# EAGLE design 130909_MAXSONAR_AriloRX_0_0 (EAGLE 6.4)
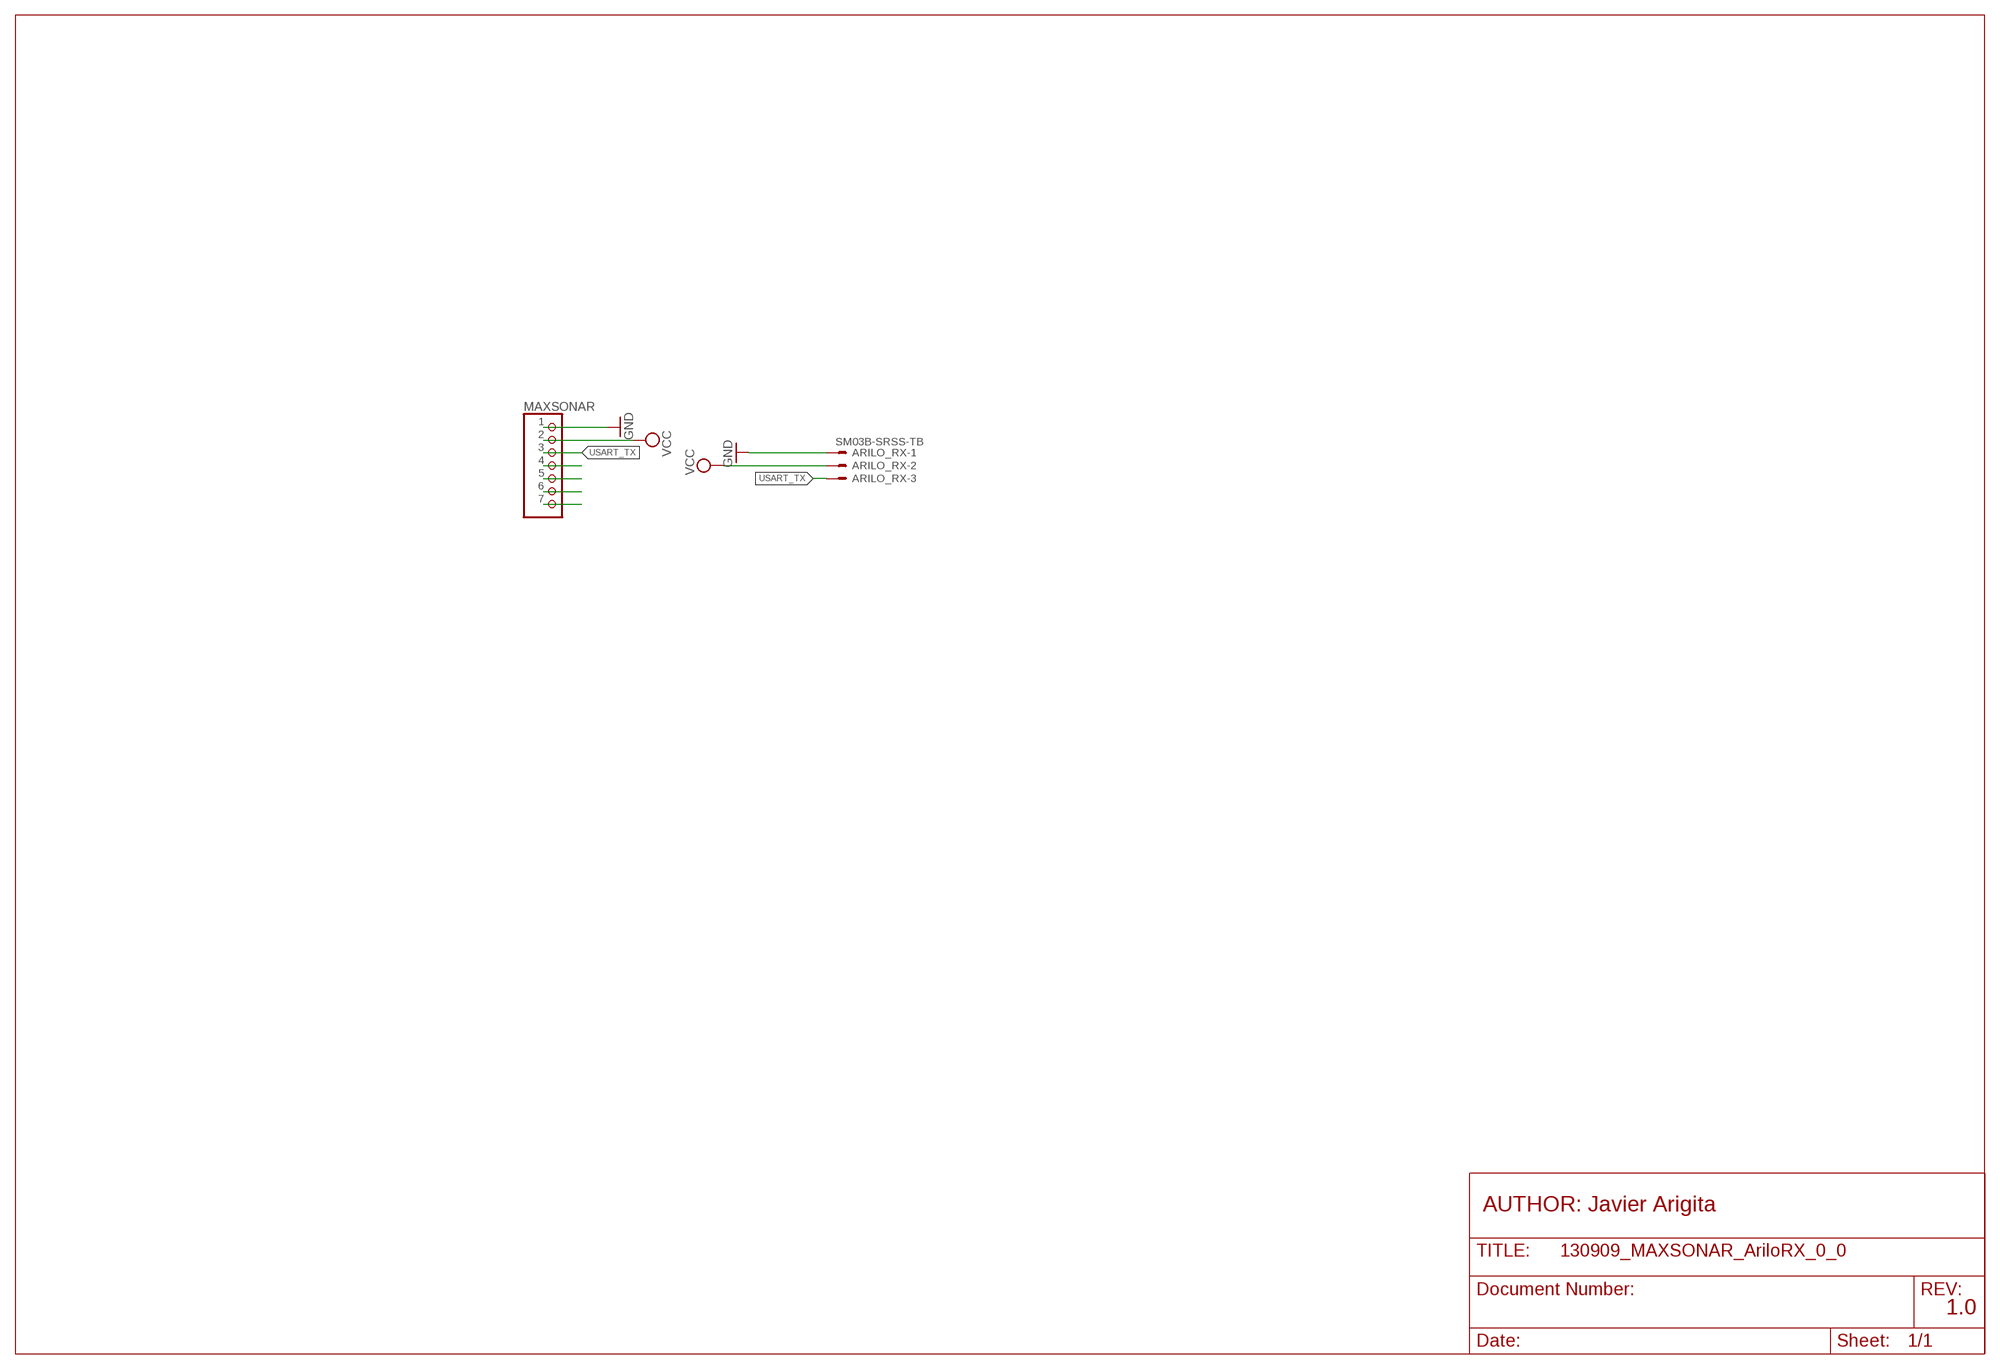
[diagram p0: schematic, sheet 1]

## Parts
ARILO_RX  SM03B-SRSS-TB  [SM03B-SRSS-TB]
MAXSONAR  PINHD-1X7  [1X07]

## Nets
GND: ARILO_RX.1 MAXSONAR.1
N$4: MAXSONAR.4
N$5: MAXSONAR.5
N$6: MAXSONAR.6
N$7: MAXSONAR.7
USART_TX: ARILO_RX.3 MAXSONAR.3
VCC: ARILO_RX.2 MAXSONAR.2

## Notes on the sheet
- AUTHOR: Javier Arigita
- 1.0

## Library data of the parts
ARILO_RX = con-jst2:?M03B-SRSS-TB: Disconnectable Crimp style connector, 1.0mm pitch 3 contacts
MAXSONAR = pinhead:PINHD-1X7: PIN HEADER

## Board
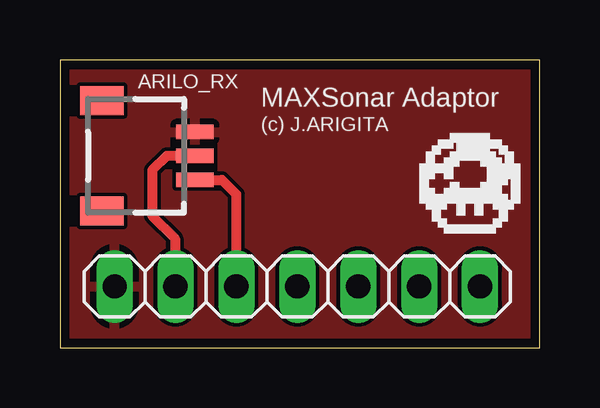
[diagram p1: board, top side]
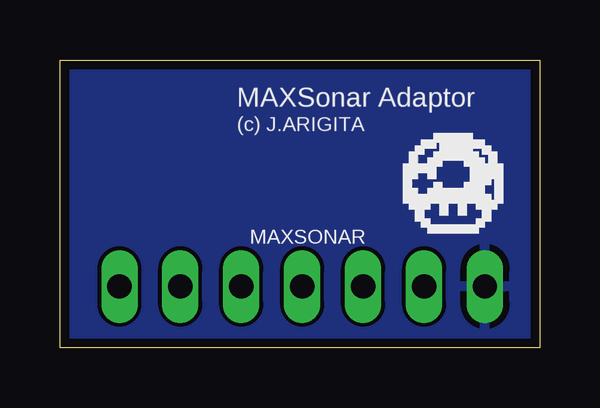
[diagram p2: board, bottom side, seen from below]

Size 20 x 12 mm. Coordinates in mm from the lower left corner, seen from the top.
Outline: 0,0 20,0 20,12 0,12 0,0
Copper layers (1*16): Top 0.0356mm / dielectric 1.5011mm / Bottom 0.0356mm
Design rules "LaenPCBOrder": minimum track width 6mil, minimum drill 13mil, track to track 6mil, track to pad 6mil, pad to pad 6mil, via to via 6mil, smd to smd 6mil, copper to edge 15mil, drill to drill 6mil, minimum pad ring 7mil, minimum via ring 7mil, stop-mask expansion 4mil, vias tented up to drill 0mil, thermal gap 10mil

### Footprints (pad centres in the part's own frame; a part is rotated, then mirrored left to right if it is on the bottom)
SM03B-SRSS-TB = smd 0.6 x 1.55: 1 -1,2.975; 2 0,2.975; 3 1,2.975 | smd 1.2 x 1.8: FIT@1 -2.3,-0.9; FIT@2 2.3,-0.9
1X07 = drill 1.016 long: 1 -7.62,0; 2 -5.08,0; 3 -2.54,0; 4 0,0; 5 2.54,0; 6 5.08,0; 7 7.62,0

### Placement (x,y rotation side)
ARILO_RX  2.65,8 270 top
MAXSONAR  9.9,2.55 0 top

### Tracks (layer width: path | path; a pad name or v marks a point on that pad's centre or on a via)
GND
  pour Top: 19.8,0.2 0.2,0.2 0.2,11.8 19.8,11.8
  pour Bottom: 19.8,0.2 0.2,0.2 0.2,11.8 19.8,11.8
USART_TX
  Top 0.406: ARILO_RX.3 6.75,7 7.35,6.4 MAXSONAR.3
VCC
  Top 0.406: ARILO_RX.2 4.45,8 3.85,7.4 3.85,5.5 4.8,4.55 4.8,2.57 MAXSONAR.2

### Text on the board
tNames: MAXSonar Adaptor | (c) J.ARIGITA
bNames: MAXSonar Adaptor | (c) J.ARIGITA